# EAGLE design EEG (EAGLE 9.2.2)
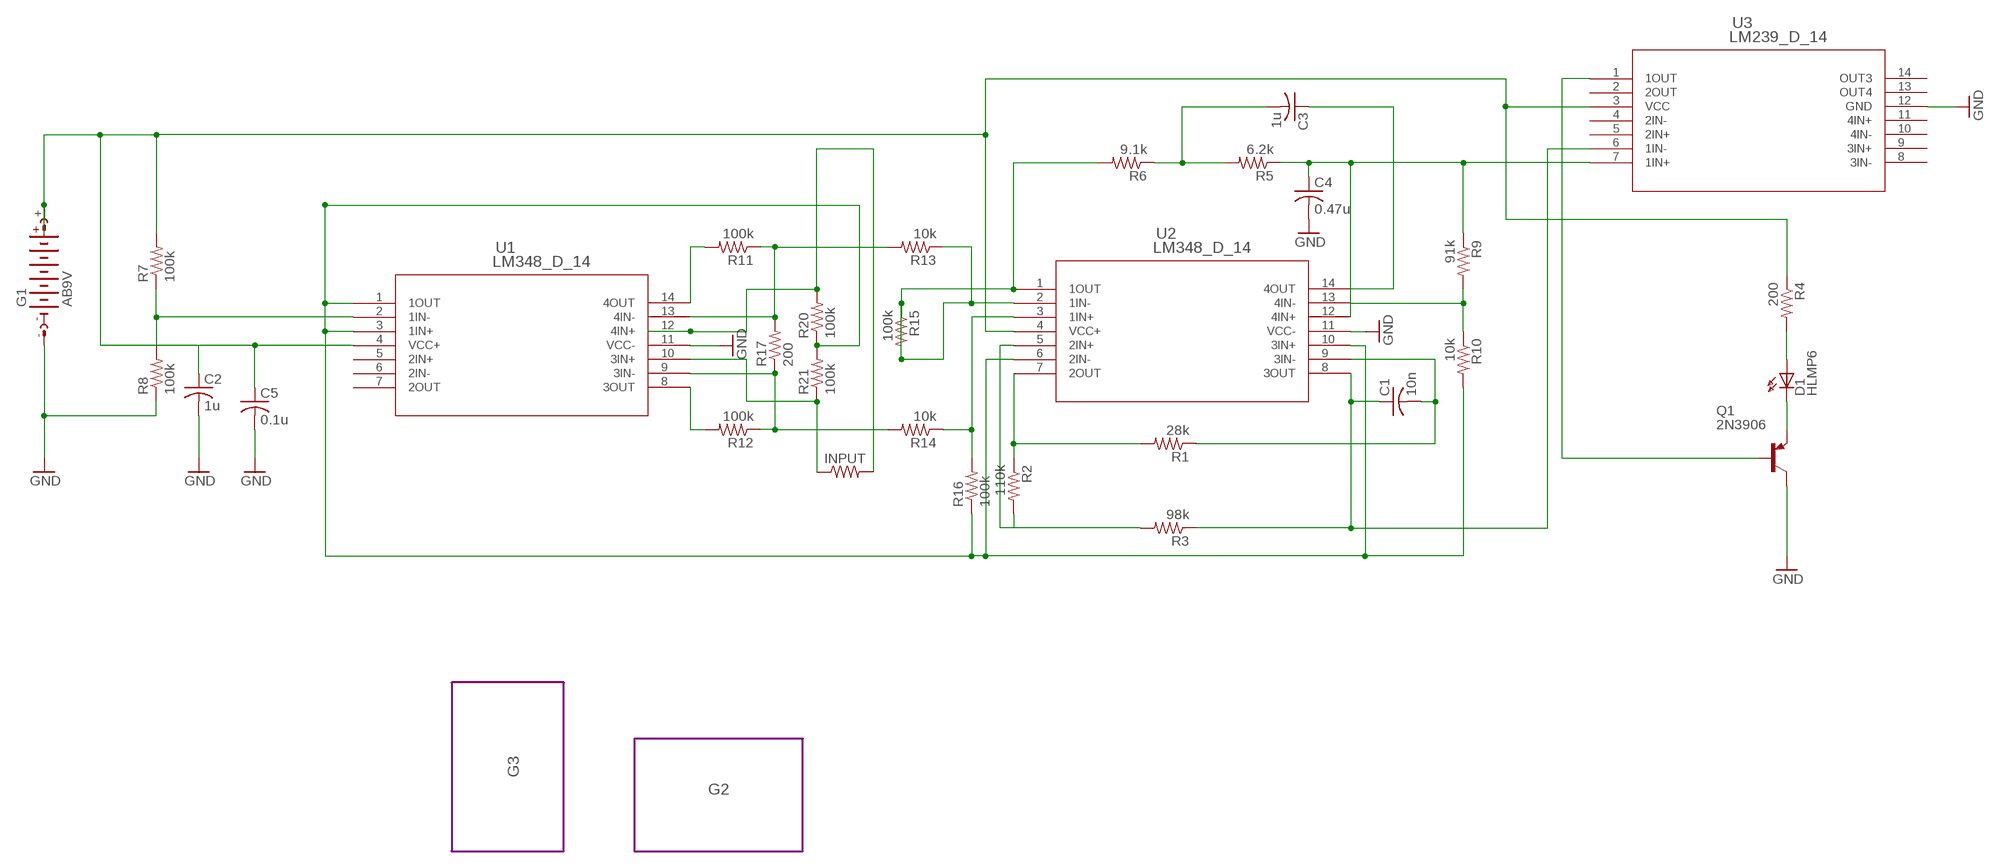
[diagram p0: schematic, sheet 1]

## Parts
C1  10n  C-US025-040X050  [C025-040X050]
C2  1u  C-US025-040X050  [C025-040X050]
C3  1u  C-US025-040X050  [C025-040X050]
C4  0.47u  C-US025-040X050  [C025-040X050]
C5  0.1u  C-US025-040X050  [C025-040X050]
D1  HLMP6  [HLMP6]
G1  AB9V  [AB9V]
INPUT  R-US_0207/12  [0207/12]
Q1  2N3906  [TO92]
R1  28k  R-US_0207/5V  [0207/5V]
R2  110k  R-US_0207/5V  [0207/5V]
R3  98k  R-US_0207/5V  [0207/5V]
R4  200  R-US_0207/5V  [0207/5V]
R5  6.2k  R-US_0207/5V  [0207/5V]
R6  9.1k  R-US_0207/5V  [0207/5V]
R7  100k  R-US_0207/5V  [0207/5V]
R8  100k  R-US_0207/5V  [0207/5V]
R9  91k  R-US_0207/5V  [0207/5V]
R10  10k  R-US_0207/5V  [0207/5V]
R11  100k  R-US_0207/5V  [0207/5V]
R12  100k  R-US_0207/5V  [0207/5V]
R13  10k  R-US_0207/5V  [0207/5V]
R14  10k  R-US_0207/5V  [0207/5V]
R15  100k  R-US_0207/5V  [0207/5V]
R16  100k  R-US_0207/5V  [0207/5V]
R17  200  R-US_0207/5V  [0207/5V]
R20  100k  R-US_0207/5V  [0207/5V]
R21  100k  R-US_0207/5V  [0207/5V]
U1  LM348_D_14  [D14]
U2  LM348_D_14  [D14]
U3  LM239_D_14  [D14]

## Module instances
G2 = G
G3 = G

## Nets
2: R2.2 R3.2 U2.5(2IN+)
GND: C2.2 C4.2 C5.2 G1.- Q1.1(C) R8.1 U1.11(VCC-) U2.11(VCC-) U3.12(GND)
N$1: C3.2 R5.2 R6.1
N$2: C4.1 R5.1 R9.1 U2.12(4IN+) U3.7(1IN+)
N$3: R7.1 R8.2 U1.2(1IN-)
N$4: C2.1
N$5: R12.1 R14.2 R17.1 U1.9(3IN-)
N$6: INPUT.2 R20.2 U1.12(4IN+)
N$7: INPUT.1 R21.1 U1.10(3IN+)
N$8: R11.1 R13.2 R17.2 U1.13(4IN-)
N$9: R12.2 U1.8(3OUT)
N$10: R14.1 R16.2 U2.3(1IN+)
N$11: R11.2 U1.14(4OUT)
N$12: R6.2 R13.1 R15.1 R15.2 U2.1(1OUT) U2.2(1IN-)
N$13: R10.2 R16.1 R20.1 R21.2 U1.1(1OUT) U1.3(1IN+) U2.6(2IN-) U2.10(3IN+)
N$14: C3.1 U2.14(4OUT)
N$15: R1.2 R2.1 U2.7(2OUT)
N$17: R9.2 R10.1 U2.13(4IN-)
N$18: C1.2 R1.1 U2.9(3IN-)
N$19: C1.1 R3.1 U2.8(3OUT) U3.6(1IN-)
N$20: C5.1 G1.+ R4.1 R7.2 U1.4(VCC+) U2.4(VCC+) U3.3(VCC)
N$21: Q1.2(B) U3.1(1OUT)
N$22: D1.K Q1.3(E)
N$23: D1.A R4.2
Unconnected: U1.5(2IN+) U1.6(2IN-) U1.7(2OUT) U3.2(2OUT) U3.4(2IN-) U3.5(2IN+) U3.8(3IN-) U3.9(3IN+) U3.10(4IN-) U3.11(4IN+) U3.13(OUT4) U3.14(OUT3)

## Library data of the parts
C1-C5 = rcl:C-US: CAPACITOR, American symbol; SPICEPREFIX: C
D1 = display-hp:HLMP6: LED 2mm horizontal; MF: AGILENT TECHNOLOGIES; MPN: HLMP-6500; OC_FARNELL: 1652490; OC_NEWARK: 40K0088
G1 = battery:AB9V: 9-V BATTERY CLIP
INPUT R1-R17 R20 R21 = rcl:R-US_: RESISTOR, American symbol; SPICEPREFIX: R
Q1 = transistor-pnp:2N3906: PNP Transistor
U1 U2 = LM348:LM348_D_14: Quadruple Operational Amplifiers; DATASHEETURL: httpwww.ti.comlitgpnLM348; FAMILY_NAME: STANDARD LINEAR AMPLIFIER; GENERIC_PART_NUMBER: LM348; INDUSTRY_STD_PKG_TYPE: SOIC; MANUFACTURER: Texas Instruments; PACKAGE_DESIGNATOR: D; PIN_COUNT: 14
U3 = EE449_Parts:LM239_D_14: Quad Differential Comparator; DATASHEETURL: httpwww.ti.comlitgpnLM239; FAMILY_NAME: COMPARATOR; GENERIC_PART_NUMBER: LM239; INDUSTRY_STD_PKG_TYPE: SOIC; MANUFACTURER: Texas Instruments; PACKAGE_DESIGNATOR: D; PIN_COUNT: 14

## Module G
Ports: 

### Library data of the parts

## Net classes
0 default: width 0.305 mm, drill 0.508 mm, clearance 0.254 mm

## Board
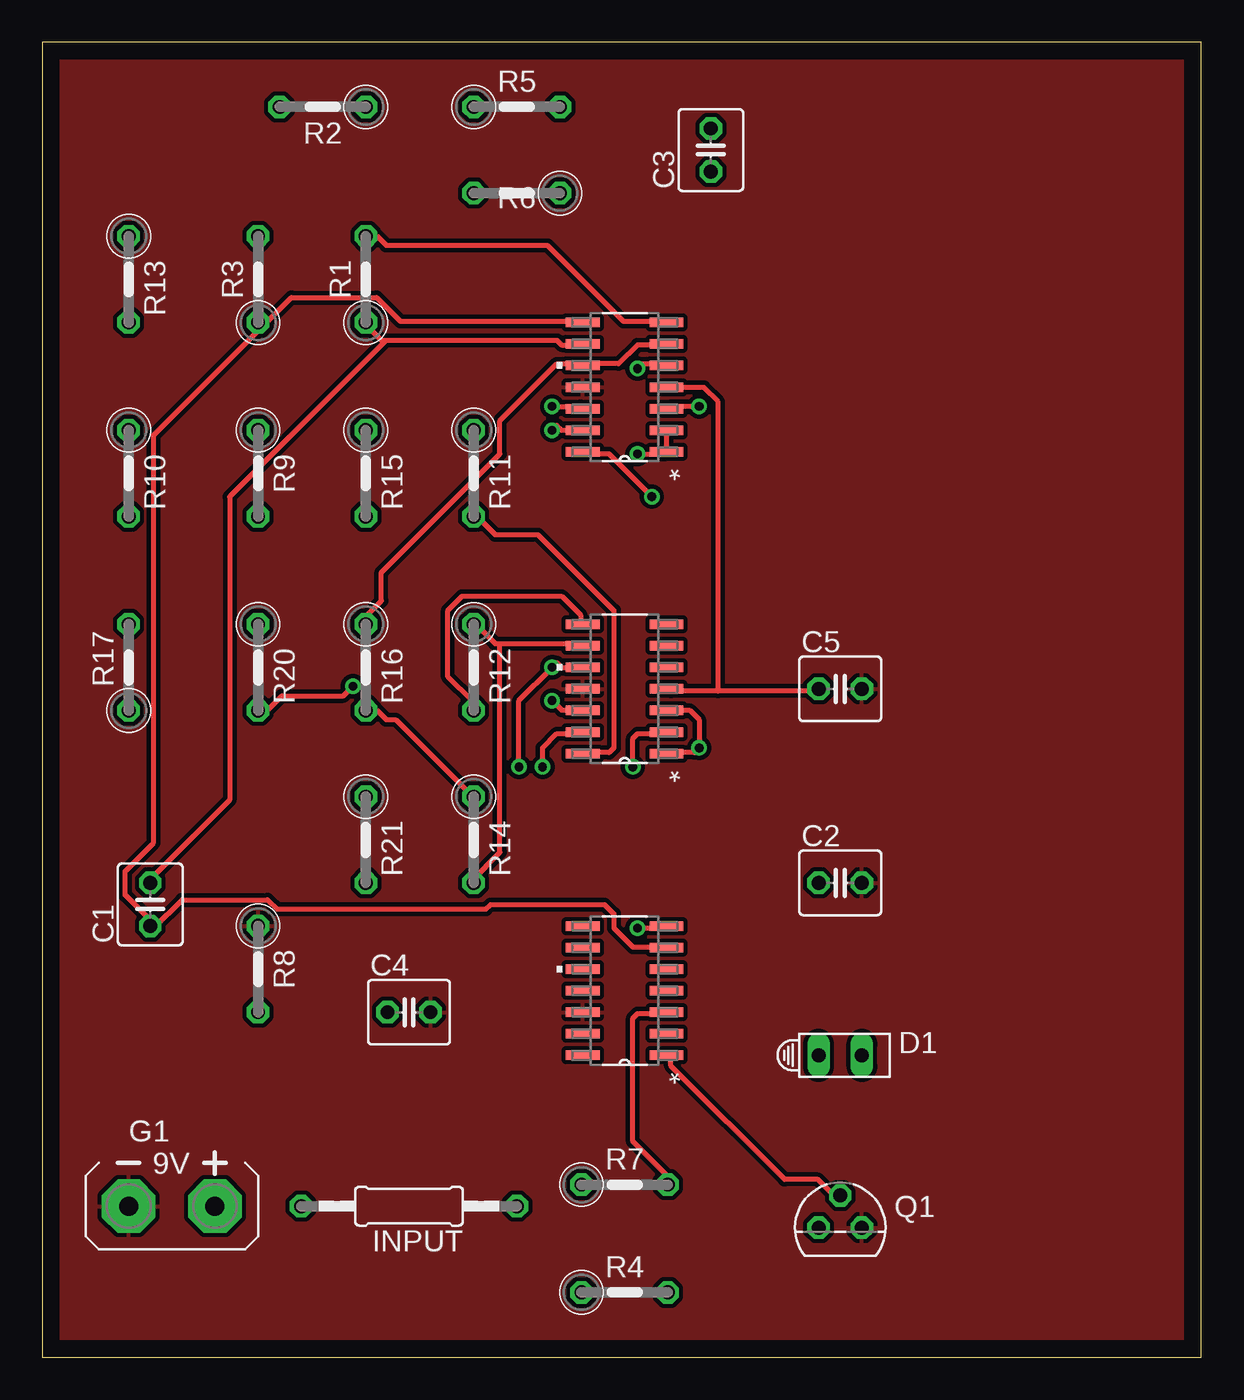
[diagram p1: board, top side]
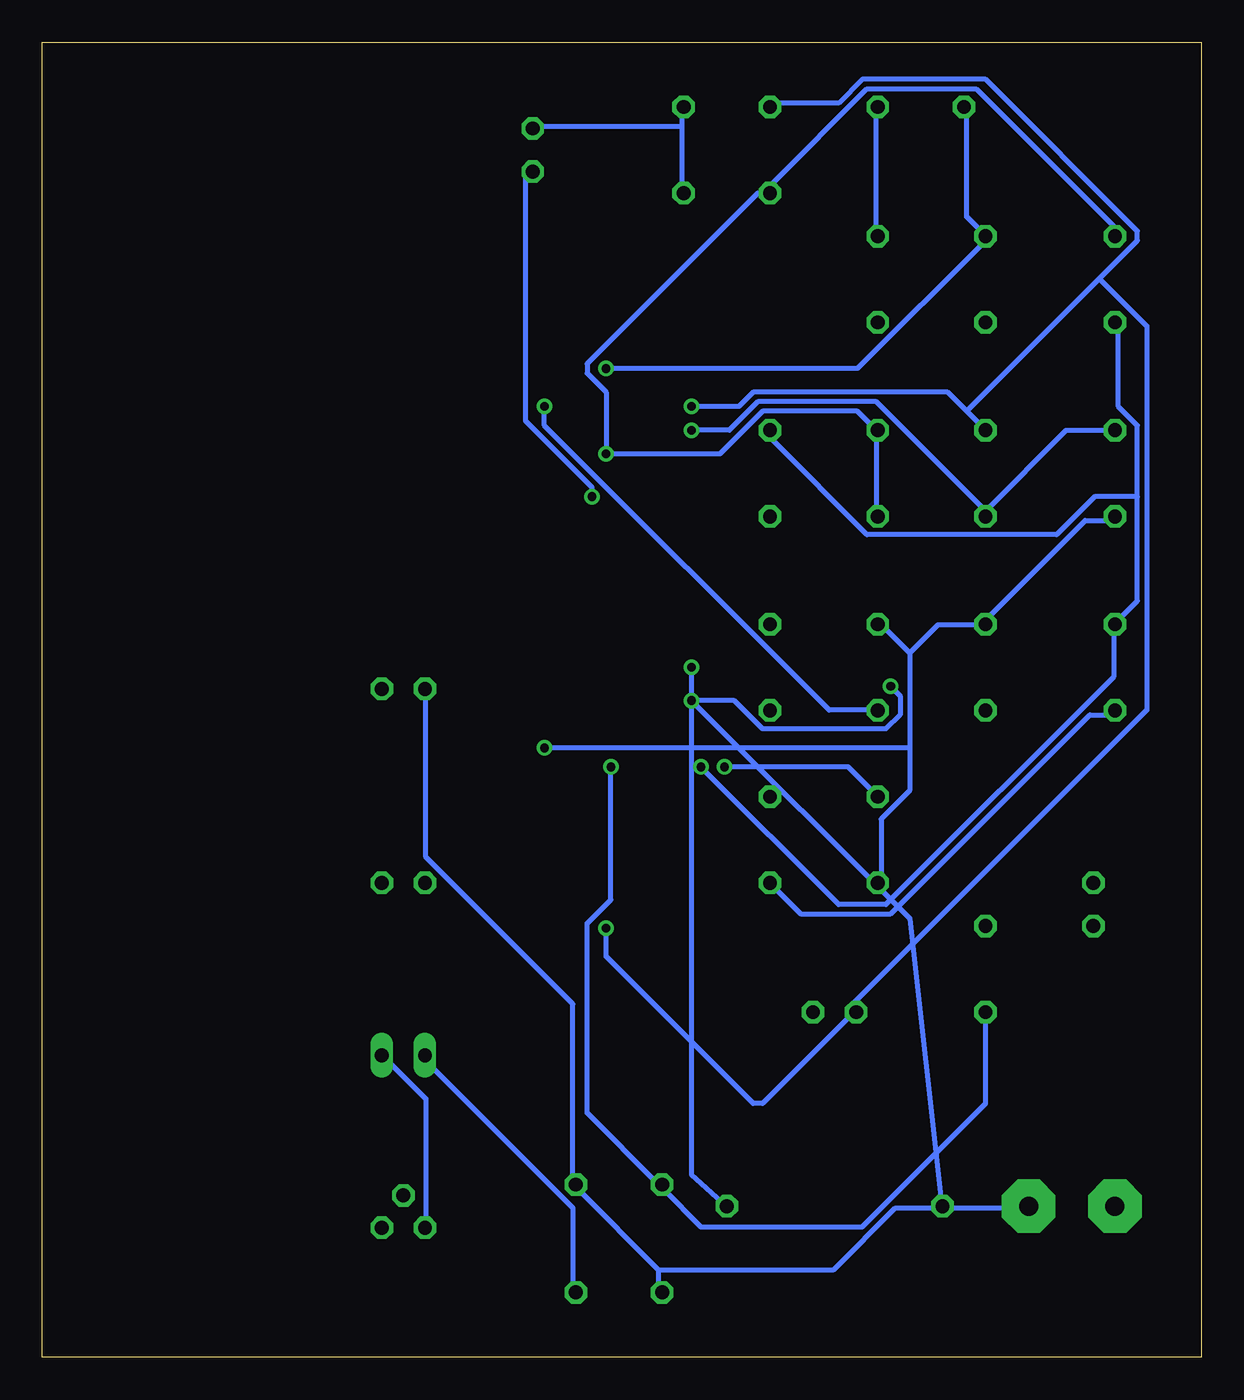
[diagram p2: board, bottom side, seen from below]

Size 68.25 x 77.46 mm. Coordinates in mm from the lower left corner, seen from the top.
Outline: 0,0 68.25,0 68.25,77.46 0,77.46 0,0
Copper layers (1*16): Top 0.035mm / dielectric 1.5mm / Bottom 0.035mm
Design rules "default": minimum track width 6mil, minimum drill 0.35mm, track to track 6mil, track to pad 6mil, pad to pad 6mil, via to via 6mil, smd to smd 6mil, copper to edge 40mil, drill to drill 6mil, minimum pad ring 10mil, minimum via ring 8mil, stop-mask expansion 4mil, vias tented up to drill 0mil, thermal gap 10mil

### Footprints (pad centres in the part's own frame; a part is rotated, then mirrored left to right if it is on the bottom)
C025-040X050 = drill 0.813 octagon: 1 -1.27,0; 2 1.27,0
HLMP6 = drill 0.813 long: A -1.27,0; K 1.27,0
AB9V = drill 1.118 pad 3.15 octagon: + 0,2.54; - 0,-2.54
0207/12 = drill 0.813 octagon: 1 -6.35,0; 2 6.35,0
TO92 = drill 0.813 octagon: 1 1.27,0; 2 0,1.905; 3 -1.27,0
0207/5V = drill 0.813 octagon: 1 -2.54,0; 2 2.54,0
D14 = smd 1.981 x 0.559: 1 -2.464,3.81; 2 -2.464,2.54; 3 -2.464,1.27; 4 -2.464,0; 5 -2.464,-1.27; 6 -2.464,-2.54; 7 -2.464,-3.81; 8 2.464,-3.81; 9 2.464,-2.54; 10 2.464,-1.27; 11 2.464,0; 12 2.464,1.27; 13 2.464,2.54; 14 2.464,3.81

### Placement (x,y rotation side)
C1  6.35,26.67 90 top
C2  46.99,27.94 0 top
C3  39.37,71.12 90 top
C4  21.59,20.32 0 top
C5  46.99,39.37 0 top
D1  46.99,17.78 0 top
G1  7.62,8.89 270 top
INPUT  21.59,8.89 180 top
Q1  46.99,7.62 0 top
R1  19.05,63.5 90 top
R2  16.51,73.66 180 top
R3  12.7,63.5 90 top
R4  34.29,3.81 0 top
R5  27.94,73.66 0 top
R6  27.94,68.58 180 top
R7  34.29,10.16 0 top
R8  12.7,22.86 270 top
R9  12.7,52.07 270 top
R10  5.08,52.07 270 top
R11  25.4,52.07 270 top
R12  25.4,40.64 270 top
R13  5.08,63.5 270 top
R14  25.4,30.48 270 top
R15  19.05,52.07 270 top
R16  19.05,40.64 270 top
R17  5.08,40.64 90 top
R20  12.7,40.64 270 top
R21  19.05,30.48 270 top
U1  34.29,39.37 180 top
U2  34.29,57.15 180 top
U3  34.29,21.59 180 top

### Tracks (layer width: path | path; a pad name or v marks a point on that pad's centre or on a via)
2  (via drill 0.51)
  Top 0.305: v35.05,58.24 35.33,58.52 36.73,58.52 U2.5
  Bottom 0.305: v35.05,58.24 20.24,58.24 12.7,65.79 R3.2 12.7,66.06 13.82,67.18 13.82,73.61 R2.2
GND
  pour Top: -16.51,80.01 -16.51,-2.54 85.09,-2.54 86.36,-1.27 86.36,80.01
N$1
  Bottom 0.305: 30.58,72.49 30.58,73.61 R5.2 | 30.58,72.49 30.58,68.58 R6.1 | 30.58,72.49 39.24,72.49 C3.2
N$2  (via drill 0.51)
  Top 0.305: v35.05,25.27 36.73,25.27 U3.7 | v30.02,56.01 31.7,56.01 U2.12
  Bottom 0.305: v35.05,25.27 35.05,23.6 26.39,14.93 25.83,14.93 20.52,20.24 C4.1 20.69,20.64 3.2,38.12 3.2,60.76 5.99,63.55 | v30.02,56.01 27.23,56.01 26.39,56.84 14.94,56.84 13.82,55.73 | R9.1 13.82,55.73 | 13.82,55.73 5.99,63.55 | 5.99,63.55 3.76,65.79 3.76,66.34 12.7,75.29 19.96,75.29 21.36,73.89 25.27,73.89 R5.1
N$3  (via drill 0.51)
  Top 0.305: v34.77,34.77 34.77,36.45 35.05,36.73 36.73,36.73 U1.2
  Bottom 0.305: v34.77,34.77 34.77,26.95 36.17,25.55 36.17,14.38 31.98,10.19 R7.1 31.7,9.91 29.46,7.67 19.96,7.67 12.7,14.93 R8.2
N$5
  Top 0.305: 26.95,42.04 26.67,42.04 25.83,42.88 25.55,42.88 25.27,43.15 R12.1 | 26.95,42.04 31.7,42.04 U1.9 | 26.95,42.04 26.95,29.74 25.27,28.07 R14.2
  Bottom 0.305: R17.1 5.16,37.85 6.55,37.85 18.29,26.11 23.6,26.11 25.27,27.79 R14.2
N$6  (via drill 0.51)
  Top 0.305: v30.02,38.68 30.58,38.12 31.7,38.12 U1.12 | v18.29,39.52 17.73,38.96 14.1,38.96 13.26,38.12 12.7,38.12 R20.2
  Bottom 0.305: v18.29,39.52 17.73,38.96 17.73,37.85 18.57,37.01 25.83,37.01 27.51,38.68 v30.02,38.68 17.15,25.81 INPUT.2
N$7  (via drill 0.51)
  Top 0.305: U1.10 30.58,40.64 30.3,40.92 v30.02,40.64 28.07,38.68 v28.07,34.77
  Bottom 0.305: v28.07,34.77 20.8,34.77 R21.1 | v30.02,40.64 30.02,10.76 INPUT.1
N$8  (via drill 0.51)
  Top 0.305: v29.46,34.77 29.46,35.89 30.3,36.73 31.7,36.73 U1.13
  Bottom 0.305: v29.46,34.77 21.36,26.67 18.57,26.67 5.16,40.08 5.16,43.15 R17.2 4.88,43.43 3.76,44.55 3.76,50.7 | 3.76,50.7 3.76,54.89 4.88,56.01 4.88,60.76 R13.2 | 3.76,50.7 6.27,50.7 8.51,48.46 19.68,48.46 25.27,54.05 25.27,54.61 R11.1
N$9
  Top 0.305: U1.8 31.7,43.43 31.7,43.71 30.58,44.83 24.71,44.83 23.88,43.99 23.88,40.08 25.27,38.68 25.27,38.12 R12.2
N$10  (via drill 0.51)
  Top 0.305: v38.68,56.01 37.01,56.01 U2.3 | R14.1 25.27,33.1 20.8,37.57 20.24,37.57 19.68,38.12 19.13,38.12 R16.2
  Bottom 0.305: v38.68,56.01 38.68,54.89 21.92,38.12 19.13,38.12 R16.2
N$11
  Top 0.305: U1.14 31.98,35.61 33.38,35.61 33.66,35.89 33.66,43.99 29.18,48.46 26.67,48.46 25.55,49.58 R11.2
N$12  (via drill 0.51)
  Top 0.305: U2.2 36.73,54.61 36.73,53.49 U2.1 36.73,53.21 v35.05,53.21
  Bottom 0.305: 19.13,54.61 20.24,55.73 25.83,55.73 28.35,53.21 v35.05,53.21 35.05,56.84 36.17,57.96 36.17,58.52 26.11,68.58 R6.2 25.27,68.58 25.27,69.14 19.68,74.73 13.26,74.73 5.16,66.62 5.16,66.06 R13.1 | 19.13,54.61 19.13,49.58 R15.2 | 19.13,54.61 R15.1
N$13  (via drill 0.51)
  Top 0.305: U2.6 36.73,59.64 35.05,59.64 33.93,58.52 31.98,58.52 U2.10 31.7,58.52 30.3,58.52 26.95,55.17 26.95,53.21 19.96,46.23 19.96,44.55 18.85,43.43 R16.1 | U1.1 37.01,35.61 38.41,35.61 v38.68,35.89 38.68,37.57 38.12,38.12 37.01,38.12 U1.3
  Bottom 0.305: 17.17,41.48 17.17,35.89 | 17.17,35.89 17.17,33.38 18.85,31.7 18.85,28.07 R21.2 | 17.17,41.48 18.85,43.15 R16.1 | 17.17,41.48 15.49,43.15 12.7,43.15 R20.1 12.7,43.43 6.83,49.3 5.16,49.3 R10.2 | 17.17,35.89 v38.68,35.89
N$14  (via drill 0.51)
  Top 0.305: v35.89,50.7 33.38,53.21 31.98,53.21 U2.14
  Bottom 0.305: v35.89,50.7 35.89,51.26 39.8,55.17 39.8,69.42 C3.1
N$15
  Top 0.305: U2.7 36.73,61.04 34.21,61.04 29.74,65.51 20.24,65.51 19.68,66.06 19.13,66.06 R1.2
  Bottom 0.305: R2.1 19.13,73.61 19.13,66.06 R1.2
N$17  (via drill 0.51)
  Top 0.305: U2.13 30.58,54.61 30.3,54.89 v30.02,54.61
  Bottom 0.305: v30.02,54.61 27.79,54.61 26.11,56.29 19.13,56.29 12.7,49.86 | 12.7,49.86 R9.2 12.7,49.58 | R10.1 7.95,54.61 12.7,49.86
N$18
  Top 0.305: 20.24,59.92 19.96,59.92 19.41,60.48 19.13,60.48 18.85,60.76 R1.1 | 20.24,59.92 30.3,59.92 30.58,59.64 31.7,59.64 U2.9 | 20.24,59.92 11.02,50.7 11.02,32.82 6.55,28.35 6.55,28.07 C1.2
N$19
  Top 0.305: U2.8 31.7,61.04 21.08,61.04 19.68,62.43 14.66,62.43 13.26,61.04 12.7,61.04 R3.1 12.7,60.48 6.55,54.33 6.55,30.3 4.88,28.63 4.88,27.23 6.55,25.55 C1.1 6.55,25.27 8.23,26.95 13.26,26.95 13.82,26.39 26.11,26.39 26.39,26.67 33.1,26.67 33.66,26.11 33.66,25.27 34.77,24.16 36.73,24.16 U3.6
N$20
  Top 0.305: 39.8,39.24 45.67,39.24 C5.1 | 39.8,39.24 37.01,39.24 U1.4 | 39.8,39.24 39.8,56.29 38.96,57.12 37.01,57.12 U2.4 | U3.3 36.73,20.24 35.05,20.24 34.77,19.96 34.77,12.7 36.73,10.74 36.73,10.19 R7.2
  Bottom 0.305: 31.98,5.16 31.98,4.04 R4.1 | 31.98,5.16 36.73,9.91 R7.2 37.01,10.19 37.01,20.8 45.67,29.46 45.67,39.24 C5.1 | 31.98,5.16 21.64,5.16 18.01,8.79 10.19,8.79 G1.+
N$21
  Top 0.305: U3.1 37.01,17.73 37.01,17.17 43.71,10.46 45.67,10.46 46.79,9.35 Q1.2
N$22
  Bottom 0.305: Q1.3 45.67,7.67 45.67,15.21 48.18,17.73 D1.K
N$23
  Bottom 0.305: R4.2 37.01,4.04 37.01,8.79 45.95,17.73 D1.A